# EAGLE design Word Clock (EAGLE 8.1.1)
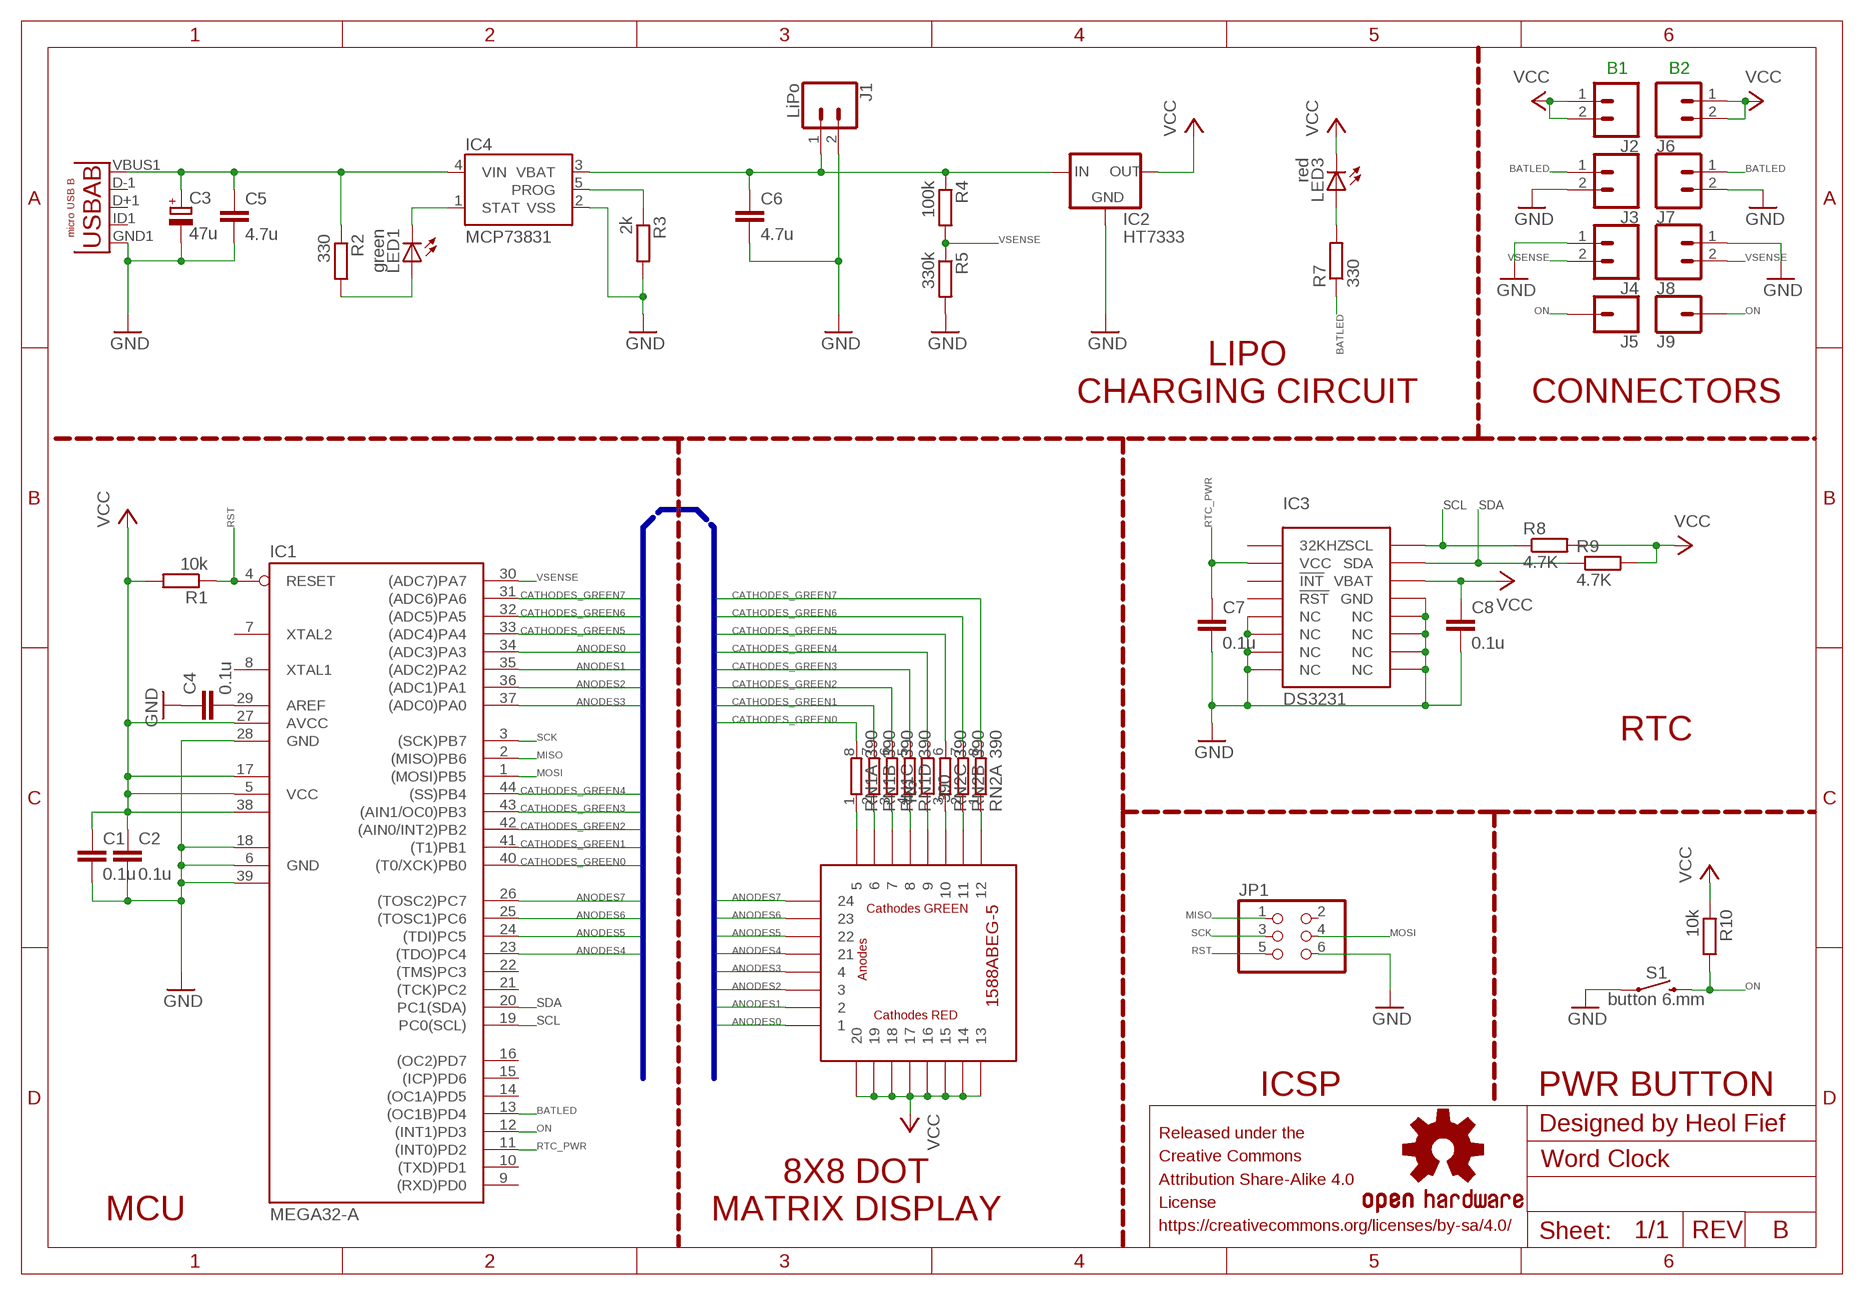
[diagram p0: schematic, sheet 1]

## Parts
C1  0.1u  C-EUC0805  [C0805]
C2  0.1u  C-EUC0805  [C0805]
C3  47u  CPOL-EUD/7343-31W  [D/7343-31W]
C4  0.1u  C-EUC0805  [C0805]
C5  4.7u  C-EUC0805  [C0805]
C6  4.7u  C-EUC0805  [C0805]
C7  0.1u  C-EUC0805  [C0805]
C8  0.1u  C-EUC0805  [C0805]
IC1  MEGA32-A  [TQFP44]
IC2  HT7333  [SOT-89]
IC3  DS3231  DS3231SOIC-16W  [SOIC-16W]
IC4  MCP73831  [SOT23-5]
J1  LiPo  CONN_02POLAR  [MOLEX-1X2]
J2  CONN_02  [1X02]
J3  CONN_02  [1X02]
J4  CONN_02  [1X02]
J5  CONN_01  [1X01]
J6  CONN_02  [1X02]
J7  CONN_02  [1X02]
J8  CONN_02  [1X02]
J9  CONN_01  [1X01]
J10  USB""  [USB-MICRO-SMD]
JP1  PINHD-2X3/90  [2X03/90]
LED1  green  LEDCHIPLED_1206  [CHIPLED_1206]
LED2  1588ABEG-5_8X8-LED_MATRIX  [1588ABEG-5_8X8-LED_MATRIX]
LED3  red  LEDCHIPLED_1206  [CHIPLED_1206]
LOGO1  OSHW-LOGOL-COPPER  [OSHW-LOGO-L_COPPER]
LOGO2  OSHW-LOGOL-COPPER  [OSHW-LOGO-L_COPPER]
R1  10k  R-EU_M0805  [M0805]
R2  330  R-EU_M0805  [M0805]
R3  2k  R-EU_M0805  [M0805]
R4  100k  R-EU_M0805  [M0805]
R5  330k  R-EU_M0805  [M0805]
R6  390  R-EU_R0805  [R0805]
R7  330  R-EU_M0805  [M0805]
R8  4.7K  R-EU_M0805  [M0805]
R9  4.7K  R-EU_M0805  [M0805]
R10  10k  R-EU_M0805  [M0805]
RN1  390  4R-N0603-ARC  [0603-ARC]
RN2  390  4R-N0603-ARC  [0603-ARC]
S1  button 6.mm  MOMENTARY-SWITCH-SPST-PTH-6.0MM  [TACTILE_SWITCH_PTH_6.0MM]

## Nets
ANODES0: IC1.34((ADC3)PA3) LED2.P$1
ANODES1: IC1.35((ADC2)PA2) LED2.P$2
ANODES2: IC1.36((ADC1)PA1) LED2.P$3
ANODES3: IC1.37((ADC0)PA0) LED2.P$4
ANODES4: IC1.23((TDO)PC4) LED2.P$21
ANODES5: IC1.24((TDI)PC5) LED2.P$22
ANODES6: IC1.25((TOSC1)PC6) LED2.P$23
ANODES7: IC1.26((TOSC2)PC7) LED2.P$24
AREF: C4.2 IC1.29(AREF)
BATLED: IC1.13((OC1B)PD4) J3.1 J7.1 R7.1
CATHODES_GREEN0: IC1.40((T0/XCK)PB0) RN1.8
CATHODES_GREEN1: IC1.41((T1)PB1) RN1.7
CATHODES_GREEN2: IC1.42((AIN0/INT2)PB2) RN1.6
CATHODES_GREEN3: IC1.43((AIN1/OC0)PB3) RN1.5
CATHODES_GREEN4: IC1.44((SS)PB4) R6.2
CATHODES_GREEN5: IC1.33((ADC4)PA4) RN2.6
CATHODES_GREEN6: IC1.32((ADC5)PA5) RN2.7
CATHODES_GREEN7: IC1.31((ADC6)PA6) RN2.8
GND: C1.2 C2.2 C3.- C4.1 C5.2 C6.2 C7.2 C8.2 IC1.6(GND) IC1.18(GND1) IC1.28(GND) IC1.39(GND2) IC2.2(GND) IC3.5(NC) IC3.6(NC) IC3.7(NC) IC3.8(NC) IC3.9(NC) IC3.10(NC) IC3.11(NC) IC3.12(NC) IC3.13(GND) IC4.2(VSS) J1.2 J3.2 J4.1 J7.2 J8.1 J10.GND1(GND) JP1.6 R3.2 R5.2 S1.1 S1.2
MISO: IC1.2((MISO)PB6) JP1.1
MOSI: IC1.1((MOSI)PB5) JP1.4
N$2: LED2.P$5 RN1.1
N$6: IC4.5(PROG) R3.1
N$7: LED2.P$6 RN1.2
N$8: LED2.P$7 RN1.3
N$9: C6.1 IC2.3(IN) IC2.4(IN) IC4.3(VBAT) J1.1 R4.1
N$10: LED2.P$8 RN1.4
N$11: LED1.A R2.2
N$12: IC4.1(STAT) LED1.C
N$13: C3.+ C5.1 IC4.4(VIN) J10.VBUS1(VBUS) R2.1
N$14: LED2.P$9 R6.1
N$15: LED2.P$10 RN2.3
N$16: LED2.P$11 RN2.2
N$17: LED2.P$12 RN2.1
N$18: LED3.A R7.2
ON: IC1.12((INT1)PD3) J5.1 J9.1 R10.2 S1.3 S1.4
RST: IC1.4(RESET) JP1.5 R1.1
RTC_PWR: C7.1 IC1.11((INT0)PD2) IC3.2(VCC)
SCK: IC1.3((SCK)PB7) JP1.3
SCL: IC1.19(PC0(SCL)) IC3.16(SCL) R8.1
SDA: IC1.20(PC1(SDA)) IC3.15(SDA) R9.1
VCC: C1.1 C2.1 C8.1 IC1.5(VCC) IC1.17(VCC1) IC1.27(AVCC) IC1.38(VCC2) IC2.1(OUT) IC3.14(VBAT) J2.1 J2.2 J6.1 J6.2 LED2.P$13 LED2.P$14 LED2.P$15 LED2.P$16 LED2.P$17 LED2.P$18 LED2.P$19 LED2.P$20 LED3.C R1.2 R8.2 R9.2 R10.1
VSENSE: IC1.30((ADC7)PA7) J4.2 J8.2 R4.2 R5.1
Unconnected: IC1.7(XTAL2) IC1.8(XTAL1) IC1.9((RXD)PD0) IC1.10((TXD)PD1) IC1.14((OC1A)PD5) IC1.15((ICP)PD6) IC1.16((OC2)PD7) IC1.21((TCK)PC2) IC1.22((TMS)PC3) IC3.1(32KHZ) IC3.3(!INT) IC3.4(!RST) J10.D+1(D+) J10.D-1(D-) J10.ID1(USBID) JP1.2 RN2.4 RN2.5

## Buses
ANODES[0..7],CATHODES_GREEN[0..7]

## Notes on the sheet
- B1 | B2
- micro USB B
- LIPO
  CHARGING CIRCUIT
- CONNECTORS
- RTC
- ICSP | PWR BUTTON
- Released under the 
  Creative Commons
  Attribution Share-Alike 4.0 
  License 
  https://creativecommons.org/licenses/by-sa/4.0/
- Designed by Heol Fief
- MCU
- 8X8 DOT
  MATRIX DISPLAY
- REV | B

## Library data of the parts
C1 C2 C4-C8 = rcl:C-EU: CAPACITOR, European symbol
C3 = rcl:CPOL-EU: POLARIZED CAPACITOR, European symbol
IC1 = atmel:MEGA32: MICROCONTROLLER 32 Kbytes FLASH 2 Kbytes SRAM 1 Kbytes EEPROM USART 8-channel 10 bit ADC Source: www.atmel.com .. doc2503.pdf; MPN: ATMEGA32-16AU; OC_FARNELL: 9171274; OC_NEWARK: 69K6677
IC2 = holtek2:HT73*
IC3 = DS3231_industrialberry:DS3231
IC4 = SparkFun-IC-Power:MCP73831: MCP73831T Li-Ion, Li-Pol Controller Miniature single cell, fully integrated Li-Ion, Li-polymer charge management controller Datasheet <http://ww1.microchip.com/downloads/en/DeviceDoc/20001984g.pdf> SparkFun Products: SparkFun ESP32 Thing <https://www.sparkfun.com/products/13907> SparkFun 9DoF Razor IMU M0 <https://www.sparkfun.com/products/14001>; PROD_ID: IC-09995
J1 = SparkFun-Connectors:CONN_02: Multi connection point. Often used as Generic Header-pin footprint for 0.1 inch spaced/style header connections On any of the 0.1 inch spaced packages, you can populate with these: Break Away Headers - Straight <https://www.sparkfun.com/products/116> (PRT-00116) Break Away Male Headers - Right Angle <https://www.sparkfun.com/products/553> (PRT-00553) Female Headers <https://www.sparkfun.com/products/115> (PRT-00115) Break Away Headers - Machine Pin <https://www.sparkfun.com/products/117> (PRT-00117) Break Away Female Headers - Swiss Machine Pin <https://www.sparkfun.com/products/743> (PRT-00743) For SCREWTERMINALS and SPRING TERMINALS visit here: Screw Terimnals on SparkFun.com <https://www.sparkfun.com/search/results?term=Screw+Terminals> (5mm/3.5mm/2.54mm spacing) This device is also useful as a general connection point to wire up your design to another part of your project. Our various solder wires solder well into these plated through hole pads. Hook-Up Wire - Assortment (Stranded, 22 AWG) <https://www.sparkfun.com/products/11375> (PRT-11375) Hook-Up Wire - Assortment (Solid Core, 22 AWG) <https://www.sparkfun.com/products/11367> (PRT-11367) View the entire wire category on our website here <https://www.sparkfun.com/categories/141> Special notes: Molex polarized connector foot print use with: PRT-08233 with associated crimp pins and housings. 2.54_SCREWTERM for use with PRT-10571. 3.5mm Screw Terminal footprints for PRT-08084 5mm Screw Terminal footprints for use with PRT-08432; SF_ID: PRT-09918
J2-J4 J6-J8 = SparkFun-Connectors:CONN_02: Multi connection point. Often used as Generic Header-pin footprint for 0.1 inch spaced/style header connections On any of the 0.1 inch spaced packages, you can populate with these: Break Away Headers - Straight <https://www.sparkfun.com/products/116> (PRT-00116) Break Away Male Headers - Right Angle <https://www.sparkfun.com/products/553> (PRT-00553) Female Headers <https://www.sparkfun.com/products/115> (PRT-00115) Break Away Headers - Machine Pin <https://www.sparkfun.com/products/117> (PRT-00117) Break Away Female Headers - Swiss Machine Pin <https://www.sparkfun.com/products/743> (PRT-00743) For SCREWTERMINALS and SPRING TERMINALS visit here: Screw Terimnals on SparkFun.com <https://www.sparkfun.com/search/results?term=Screw+Terminals> (5mm/3.5mm/2.54mm spacing) This device is also useful as a general connection point to wire up your design to another part of your project. Our various solder wires solder well into these plated through hole pads. Hook-Up Wire - Assortment (Stranded, 22 AWG) <https://www.sparkfun.com/products/11375> (PRT-11375) Hook-Up Wire - Assortment (Solid Core, 22 AWG) <https://www.sparkfun.com/products/11367> (PRT-11367) View the entire wire category on our website here <https://www.sparkfun.com/categories/141> Special notes: Molex polarized connector foot print use with: PRT-08233 with associated crimp pins and housings. 2.54_SCREWTERM for use with PRT-10571. 3.5mm Screw Terminal footprints for PRT-08084 5mm Screw Terminal footprints for use with PRT-08432
J5 J9 = SparkFun-Connectors:CONN_01: Single connection point. Often used as Generic Header-pin footprint for 0.1 inch spaced/style header connections On any of the 0.1 inch spaced packages, you can populate with these: Break Away Headers - Straight <https://www.sparkfun.com/products/116> (PRT-00116) Break Away Male Headers - Right Angle <https://www.sparkfun.com/products/553> (PRT-00553) Female Headers <https://www.sparkfun.com/products/115> (PRT-00115) Break Away Headers - Machine Pin <https://www.sparkfun.com/products/117> (PRT-00117) Break Away Female Headers - Swiss Machine Pin <https://www.sparkfun.com/products/743> (PRT-00743) This device is also useful as a general connection point to wire up your design to another part of your project. Our various solder wires solder well into these plated through hole pads. Hook-Up Wire - Assortment (Stranded, 22 AWG) <https://www.sparkfun.com/products/11375> (PRT-11375) Hook-Up Wire - Assortment (Solid Core, 22 AWG) <https://www.sparkfun.com/products/11367> (PRT-11367) View the entire wire category on our website here <https://www.sparkfun.com/categories/141> Special notes: SMTSO-256-ET is a "flush mount" nut for a 4-40 screw. We mostly use this on specialty testbeds; it is a nice way to connect hardware to your PCB at an adjustable hieght. Also note, the SNAP packages are for using a snappable style connector. We sell a baggie of snaps and they are also used on two LilyPad designs: Snap Assortment - 30 pack (male and female) <https://www.sparkfun.com/products/11347> (DEV-11347) LilyPad Arduino SimpleSnap <https://www.sparkfun.com/products/10941> (DEV-10941) LilyPad SimpleSnap Protoboard <https://www.sparkfun.com/products/10940> (DEV-10940)
J10 = MicroUSB:USB: This is a USB AB connector that is compatible with USB OTG. i.e. this connector can serve as a host or device
JP1 = pinhead:PINHD-2X3: PIN HEADER
LED1 LED3 = led:LED: LED OSRAM: - CHIPLED LG R971, LG N971, LY N971, LG Q971, LY Q971, LO R971, LY R971 LH N974, LH R974 LS Q976, LO Q976, LY Q976 LO Q996 - Hyper CHIPLED LW Q18S LB Q993, LB Q99A, LB R99A - SideLED LS A670, LO A670, LY A670, LG A670, LP A670 LB A673, LV A673, LT A673, LW A673 LH A674 LY A675 LS A676, LA A676, LO A676, LY A676, LW A676 LS A679, LY A679, LG A679 - Hyper Micro SIDELED® LS Y876, LA Y876, LO Y876, LY Y876 LT Y87S - SmartLED LW L88C, LW L88S LB L89C, LB L89S, LG L890 LS L89K, LO L89K, LY L89K LS L896, LA L896, LO L896, LY L896 - TOPLED LS T670, LO T670, LY T670, LG T670, LP T670 LSG T670, LSP T670, LSY T670, LOP T670, LYG T670 LG T671, LOG T671, LSG T671 LB T673, LV T673, LT T673, LW T673 LH T674 LS T676, LA T676, LO T676, LY T676, LB T676, LH T676, LSB T676, LW T676 LB T67C, LV T67C, LT T67C, LS T67K, LO T67K, LY T67K, LW E67C LS E67B, LA E67B, LO E67B, LY E67B, LB E67C, LV E67C, LT E67C LW T67C LS T679, LY T679, LG T679 LS T770, LO T770, LY T770, LG T770, LP T770 LB T773, LV T773, LT T773, LW T773 LH T774 LS E675, LA E675, LY E675, LS T675 LS T776, LA T776, LO T776, LY T776, LB T776 LHGB T686 LT T68C, LB T68C - Hyper Mini TOPLED® LB M676 - Mini TOPLED Santana® LG M470 LS M47K, LO M47K, LY M47K Source: http://www.osram.convergy.de LUXEON: - LUMILED® LXK2-PW12-R00, LXK2-PW12-S00, LXK2-PW14-U00, LXK2-PW14-V00 LXK2-PM12-R00, LXK2-PM12-S00, LXK2-PM14-U00 LXK2-PE12-Q00, LXK2-PE12-R00, LXK2-PE12-S00, LXK2-PE14-T00, LXK2-PE14-U00 LXK2-PB12-K00, LXK2-PB12-L00, LXK2-PB12-M00, LXK2-PB14-N00, LXK2-PB14-P00, LXK2-PB14-Q00 LXK2-PR12-L00, LXK2-PR12-M00, LXK2-PR14-Q00, LXK2-PR14-R00 LXK2-PD12-Q00, LXK2-PD12-R00, LXK2-PD12-S00 LXK2-PH12-R00, LXK2-PH12-S00 LXK2-PL12-P00, LXK2-PL12-Q00, LXK2-PL12-R00 Source: www.luxeon.com KINGBRIGHT: KA-3528ASYC Source: www.kingbright.com
LED2 = heol:1588ABEG-5_8X8-LED_MATRIX
LOGO1 LOGO2 = SparkFun-Aesthetics:OSHW-LOGO: Open-Source Hardware (OSHW) Logo This logo indicates the piece of hardware it is found on incorporates a OSHW license and/or adheres to the definition of open source hardware found here: http://freedomdefined.org/OSHW
R1-R5 R7-R10 = rcl:R-EU_: RESISTOR, European symbol
R6 = resistor:R-EU_: RESISTOR, European symbol
RN1 RN2 = resistor-dil:4R-N: Array Chip Resistor Source: RS Component / Phycomp; OC_FARNELL: unknown; OC_NEWARK: unknown
S1 = SparkFun-Switches:MOMENTARY-SWITCH-SPST: Momentary Switch (Pushbutton) - SPST Normally-open (NO) SPST momentary switches (buttons, pushbuttons). Variants PTH-12MM - 12mm square, through-hole Momentary Pushbutton Switch - 12mm Square <https://www.sparkfun.com/products/9190> (COM-09190) PTH-6.0MM, PTH-6.0MM-KIT - 6.0mm square, through-hole Mini Pushbutton Switch <https://www.sparkfun.com/products/97> (COM-00097) KIT package intended for soldering kit's - only one side of pads' copper is exposed. PTH-RIGHT-ANGLE-KIT - Right-angle, through-hole Right Angle Tactile Button <https://www.sparkfun.com/products/10791> - Used on SparkFun BigTime Watch Kit <https://www.sparkfun.com/products/11734> SMD-12MM - 12mm square, surface-mount Tactile Button - SMD (12mm) <https://www.sparkfun.com/products/12993> (COM-12993) Used on SparkFun PicoBoard <https://www.sparkfun.com/products/11888> SMD-4.5MM - 4.5mm Square Trackball Switch Used on SparkFun Blackberry Trackballer Breakout <https://www.sparkfun.com/products/13169> SMD-4.6MMX2.8MM - 4.60mm x 2.80mm, surface mount Used on SparkFun SAMD21 Mini Breakout <https://www.sparkfun.com/products/13664> SMD-5.2MM, SMD-5.2-REDUNDANT - 5.2mm square, surface-mount Mini Pushbutton Switch - SMD <https://www.sparkfun.com/products/8720> (COM-08720) Used on Arduino Pro Mini <https://www.sparkfun.com/products/11114> REDUNDANT package connects both switch circuits together SMD-6.0X3.5MM - 6.0 x 3.5mm, surface mount Momentary Reset Switch SMD <https://www.sparkfun.com/products/8229> (COM-08229) SMD-6.2MM-TALL - 6.2mm square, surface mount Tactile Button - SMD (6mm) <https://www.sparkfun.com/products/12992> Used on SparkFun Digital Sandbox <https://www.sparkfun.com/products/12651> SMD-RIGHT-ANGLE - Right-angle, surface mount Used on SparkFun Block for Intel® Edison - Arduino <https://www.sparkfun.com/products/13036>; PROD_ID: SWCH-08441; SF_SKU: COM-00097

## Board
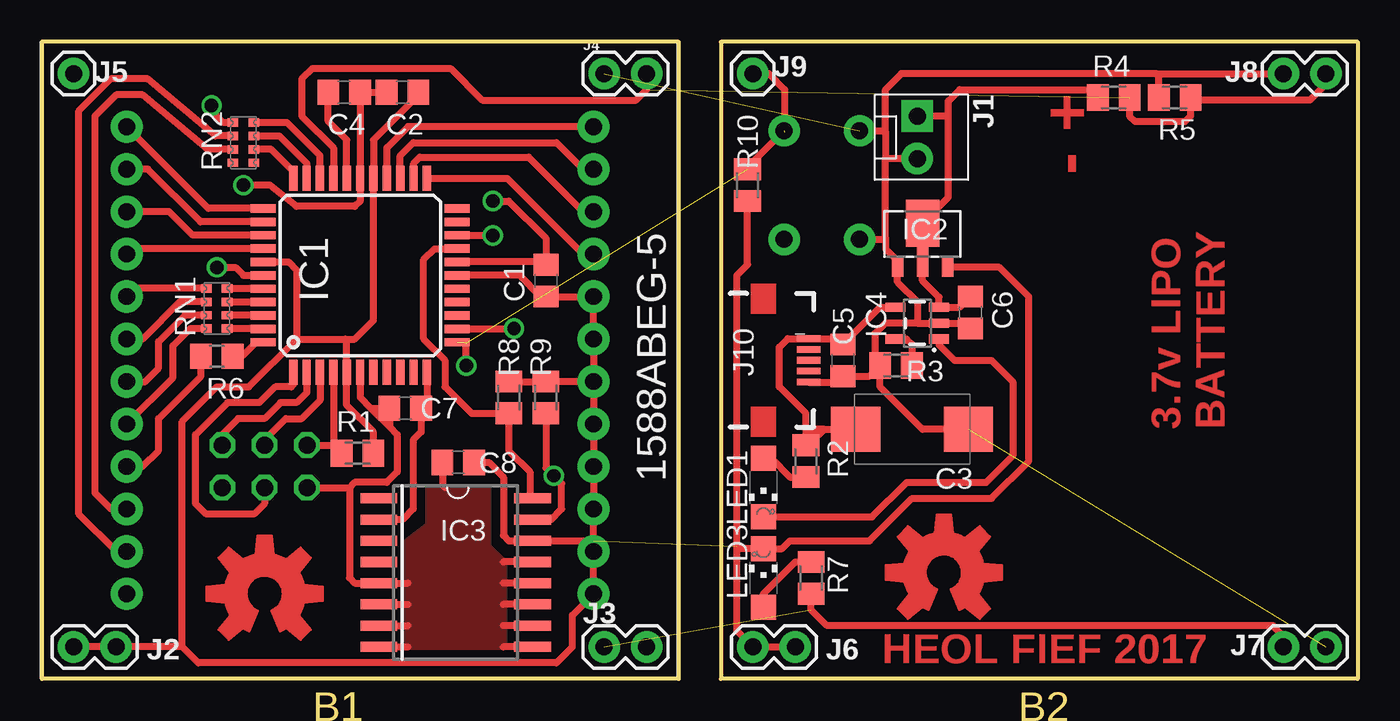
[diagram p1: board, top side]
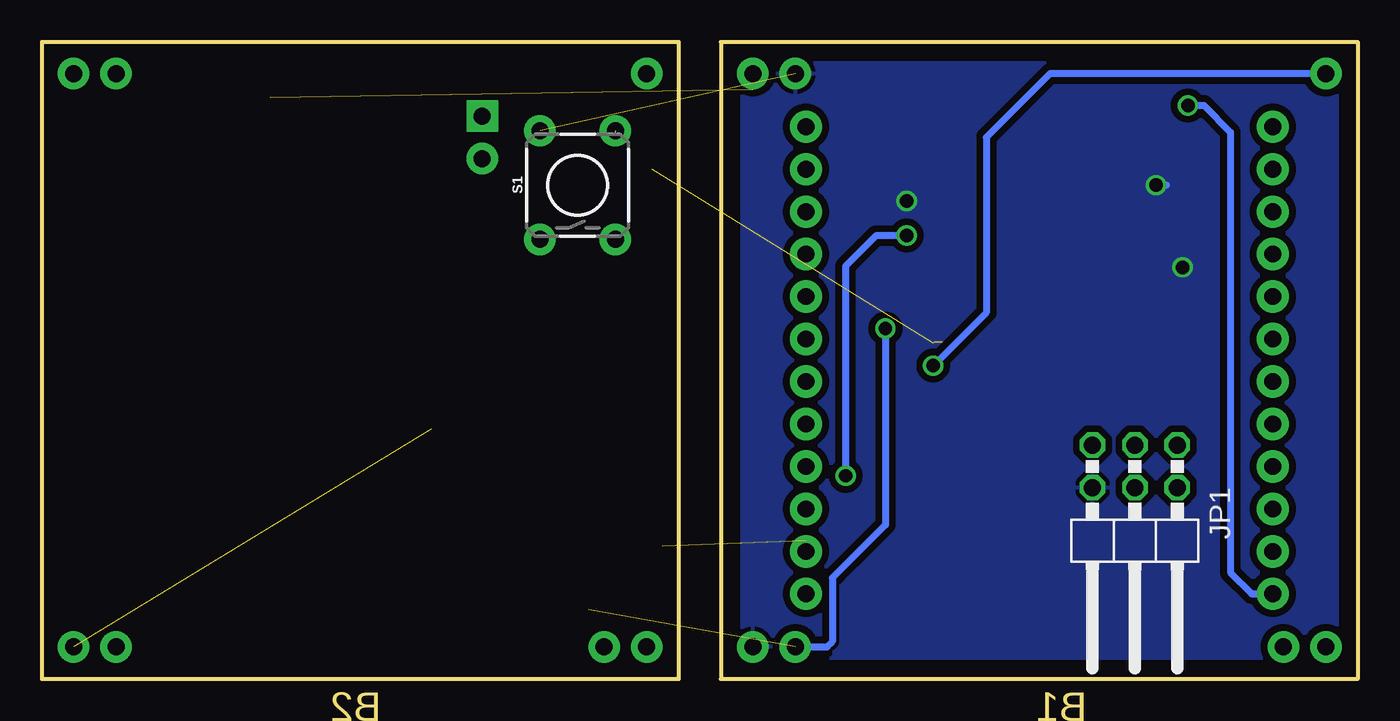
[diagram p2: board, bottom side, seen from below]

Size 78.74 x 38.1 mm. Coordinates in mm from the lower left corner, seen from the top.
Outline: 38.1,38.1 38.1,0 0,0 0,38.1 38.1,38.1
Outline: 78.74,38.1 78.74,0 40.64,0 40.64,38.1 78.74,38.1
Copper layers (1*16): Top 0.035mm / dielectric 1.5mm / Bottom 0.035mm
Design rules "default": minimum track width 10mil, minimum drill 24mil, track to track 8mil, track to pad 8mil, pad to pad 8mil, via to via 8mil, smd to smd 8mil, copper to edge 40mil, drill to drill 8mil, minimum pad ring 10mil, minimum via ring 8mil, stop-mask expansion 4mil, vias tented up to drill 0mil, thermal gap 10mil

### Footprints (pad centres in the part's own frame; a part is rotated, then mirrored left to right if it is on the bottom)
C0805 = smd 1.3 x 1.5: 1 -0.95,0; 2 0.95,0
D/7343-31W = smd 2.95 x 2.7: + 3.375,0; - -3.375,0
TQFP44 = smd 1.5 x 0.5: 1 -5.8,4; 2 -5.8,3.2; 3 -5.8,2.4; 4 -5.8,1.6; 5 -5.8,0.8; 6 -5.8,0; 7 -5.8,-0.8; 8 -5.8,-1.6; 9 -5.8,-2.4; 10 -5.8,-3.2; 11 -5.8,-4; 23 5.8,-4; 24 5.8,-3.2; 25 5.8,-2.4; 26 5.8,-1.6; 27 5.8,-0.8; 28 5.8,0; 29 5.8,0.8; 30 5.8,1.6; 31 5.8,2.4; 32 5.8,3.2; 33 5.8,4 | smd 0.5 x 1.5: 12 -4,-5.8; 13 -3.2,-5.8; 14 -2.4,-5.8; 15 -1.6,-5.8; 16 -0.8,-5.8; 17 0,-5.8; 18 0.8,-5.8; 19 1.6,-5.8; 20 2.4,-5.8; 21 3.2,-5.8; 22 4,-5.8; 34 4,5.8; 35 3.2,5.8; 36 2.4,5.8; 37 1.6,5.8; 38 0.8,5.8; 39 0,5.8; 40 -0.8,5.8; 41 -1.6,5.8; 42 -2.4,5.8; 43 -3.2,5.8; 44 -4,5.8
SOT-89 = smd 0.7 x 1.1: 1 1.5,-2.385; 2 -1.5,-2.385 | smd 0.7 x 1.8: 3 0,-2.035 | smd 2 x 2.8: 4 0,0.265
SOIC-16W = smd 0.6 x 2.2: 1 -4.445,-4.6; 2 -3.175,-4.6; 3 -1.905,-4.6; 4 -0.635,-4.6; 5 0.635,-4.6; 6 1.905,-4.6; 7 3.175,-4.6; 8 4.445,-4.6; 9 4.445,4.6; 10 3.175,4.6; 11 1.905,4.6; 12 0.635,4.6; 13 -0.635,4.6; 14 -1.905,4.6; 15 -3.175,4.6; 16 -4.445,4.6
SOT23-5 = smd 0.55 x 1.2: 1 -0.95,-1.3; 2 0,-1.3; 3 0.95,-1.3; 4 0.95,1.3; 5 -0.95,1.3
MOLEX-1X2 = drill 1.016 pad 1.88 square: 1 0,0 | drill 1.016 pad 1.88: 2 2.54,0
1X02 = drill 1.016 pad 1.88: 1 0,0; 2 2.54,0
1X01 = drill 1.016 pad 1.88: 1 0,0
USB-MICRO-SMD = smd 1.4 x 0.4: D+1 2.7,0; D-1 2.7,0.65; GND1 2.7,-1.3; ID1 2.7,-0.65; VBUS1 2.7,1.3
2X03/90 = drill 1.016 octagon: 1 -2.54,-6.35; 2 -2.54,-3.81; 3 0,-6.35; 4 0,-3.81; 5 2.54,-6.35; 6 2.54,-3.81
CHIPLED_1206 = smd 1.5 x 1.5: A 0,-1.75; C 0,1.75
1588ABEG-5_8X8-LED_MATRIX = drill 1 pad 1.93: P$1 0,0; P$2 2.54,0; P$3 5.08,0; P$4 7.62,0; P$5 10.16,0; P$6 12.7,0; P$7 15.24,0; P$8 17.78,0; P$9 20.32,0; P$10 22.86,0; P$11 25.4,0; P$12 27.94,0; P$13 27.94,27.94; P$14 25.4,27.94; P$15 22.86,27.94; P$16 20.32,27.94; P$17 17.78,27.94; P$18 15.24,27.94; P$19 12.7,27.94; P$20 10.16,27.94; P$21 7.62,27.94; P$22 5.08,27.94; P$23 2.54,27.94; P$24 0,27.94
M0805 = smd 1.3 x 1.6: 1 -0.95,0; 2 0.95,0
R0805 = smd 1.3 x 1.5: 1 -0.95,0; 2 0.95,0
0603-ARC = smd 0.5 x 0.65: 1 -1.2,-0.625; 2 -0.4,-0.625; 3 0.4,-0.625; 4 1.2,-0.625; 5 1.2,0.625; 6 0.4,0.625; 7 -0.4,0.625; 8 -1.2,0.625
TACTILE_SWITCH_PTH_6.0MM = drill 1.016 pad 1.88: 1 -3.251,2.261; 2 3.251,2.261; 3 -3.251,-2.261; 4 3.251,-2.261

### Placement (x,y rotation side)
C1  30.16,23.81 90 top
C2  21.59,35.08 180 top
C3  52.07,14.92 180 top
C4  18.1,35.08 180 top
C5  47.94,19.05 270 top
C6  55.56,21.91 270 top
C7  21.75,16.19 180 top
C8  24.92,12.94 180 top
IC1  19.05,24.13 90 top
IC2  52.7,26.99 0 top
IC3  24.77,6.35 270 top
IC4  52.39,21.27 90 top
J1  52.39,33.66 270 top
J2  4.45,1.91 180 top
J3  33.66,1.91 0 top
J4  33.66,36.2 0 top
J5  1.91,36.2 0 top
J6  45.09,1.91 180 top
J7  74.3,1.91 0 top
J8  74.3,36.2 0 top
J9  42.55,36.2 0 top
J10  43.18,19.05 0 top
JP1  13.34,7.62 180 bottom
LED1  43.18,11.43 180 top
LED2  5.08,33.02 270 top
LED3  43.18,6.03 0 top
LOGO1  53.98,6.35 0 top
LOGO2  13.34,5.08 0 top
R1  18.89,13.49 0 top
R2  45.72,13.02 270 top
R3  51.12,18.73 180 top
R4  64.14,34.77 0 top
R5  67.79,34.77 180 top
R6  10.48,19.29 0 top
R7  46.04,6.03 90 top
R8  27.94,16.83 90 top
R9  30.16,16.83 90 top
R10  42.23,29.53 90 top
RN1  10.48,22.15 270 top
RN2  12.06,32.07 270 top
S1  46.67,29.53 90 bottom

### Tracks (layer width: path | path; a pad name or v marks a point on that pad's centre or on a via)
ANODES0
  Top 0.406: IC1.34 9.97,28.13 LED2.P$1
ANODES1
  Top 0.406: IC1.35 9.5,27.33 6.35,30.48 LED2.P$2
ANODES2
  Top 0.406: IC1.36 9.03,26.53 7.62,27.94 LED2.P$3
ANODES3
  Top 0.406: IC1.37 5.41,25.73 LED2.P$4
ANODES4
  Top 0.406: LED2.P$21 32.38,25.4 27.86,29.93 IC1.23
ANODES5
  Top 0.406: IC1.24 22.25,30.82 22.62,31.19 29.13,31.19 32.38,27.94 LED2.P$22
ANODES6
  Top 0.406: IC1.25 21.45,31.29 22.23,32.07 30.8,32.07 32.38,30.48 LED2.P$23
ANODES7
  Top 0.406: IC1.26 20.65,31.76 21.91,33.02 LED2.P$24
AREF
  Top 0.406: IC1.29 18.25,32.23 17.14,33.34 C4.2
BATLED  (via drill 0.8)  (1 unrouted)
  Top 0.406: R7.1 46.04,4.13 46.99,3.17 73.66,3.17 74.3,2.54 J7.1 | IC1.13 28.23,20.93 v28.26,20.95
  Bottom 0.406: v28.26,20.95 28.26,9.21 31.43,6.03 31.43,2.22 31.75,1.91 J3.1
CATHODES_GREEN0
  Top 0.406: IC1.40 11.12,23.33 RN1.8
CATHODES_GREEN1
  Top 0.406: IC1.41 11.12,22.53 RN1.7
CATHODES_GREEN2
  Top 0.406: IC1.42 11.12,21.73 RN1.6
CATHODES_GREEN3
  Top 0.406: IC1.43 11.12,20.93 RN1.5
CATHODES_GREEN4
  Top 0.406: IC1.44 12.83,20.13 12.06,19.37 11.51,19.37 R6.2
CATHODES_GREEN5
  Top 0.406: RN2.6 13.73,31.67 15.05,30.35 IC1.33
CATHODES_GREEN6
  Top 0.406: IC1.32 15.85,30.82 14.21,32.47 RN2.7
CATHODES_GREEN7
  Top 0.406: RN2.8 14.68,33.27 16.65,31.29 IC1.31
GND  (via drill 0.8, 0.8 pad 0.8)  (2 unrouted)
  Top 0.406: IC1.39 12.06,24.13 11.59,24.61 v10.48,24.61 | IC1.6 19.05,16.83 19.68,16.19 | 18.41,11.43 18.73,11.75 20.64,11.75 21.27,12.38 21.27,14.61 20.8,15.08 | 18.41,11.43 18.41,6.03 18.73,5.71 IC3.5 21.91,5.71 | 19.68,16.19 C7.2 20.8,15.08 | 20.8,15.08 19.68,16.19 | JP1.6 18.41,11.43 | v26.99,28.57 27.94,28.57 30.16,26.35 C1.2 30.16,24.93 IC1.18 | 52.39,21.27 50.48,21.27 49.85,20.64 49.85,19.05 R3.2 | 52.39,21.27 IC4.2 55.25,21.27 C6.2 55.56,20.64 | R3.2 49.53,18.1 C5.2 47.59,17.75 J10.GND1 | 66.67,36.2 J8.1 | 66.67,36.2 51.43,36.2 50.48,35.24 50.48,32.7 | J1.2 50.48,31.11 | 52.39,21.27 52.39,22.54 51.2,23.73 IC2.2 51.2,25 50.48,25.72 50.48,26.35 | 50.48,26.35 50.48,31.11 | R5.2 66.84,36.03 66.67,36.2 | C2.2 C4.1 19.05,34.77 IC1.28 19.05,28.57 18.73,28.26 15.24,28.26 13.65,29.53 v12.06,29.53 | C3.- 52.7,14.92 50.16,17.46 R3.2 | C8.2 23.97,11.59 24.13,11.43 | IC3.6 21.91,4.45 | IC3.7 21.91,3.17 | IC3.8 21.91,1.91 | IC3.9 27.62,1.91 | IC3.10 27.62,3.17 | IC3.11 27.62,4.45 | IC3.12 27.62,5.71 | IC3.13 27.62,6.99 | 50.48,32.7 50.48,31.11 | S1.2 50.41,32.78 50.48,32.7 | S1.1 50.41,26.28 50.48,26.35
  Bottom 0.406: v12.06,29.53 11.43,29.53
  pour Bottom (isolate 0.406): 38.1,38.1 38.1,0 28.89,0 28.89,6.67 16.51,6.67 16.51,0 0,0 0,38.1
  pour Top: 23.18,11.43 26.67,11.43 26.67,7.94 27.62,6.99 27.62,1.91 21.91,1.91 21.91,8.26 23.18,9.21
MISO
  Top 0.406: JP1.1 10.79,14.61 11.75,15.56 13.34,15.56 14.29,16.51 15.24,16.51 15.85,17.12 IC1.2
MOSI
  Top 0.406: JP1.4 13.34,10.48 12.7,9.84 9.84,9.84 9.21,10.48 9.21,14.61 11.11,16.51 13.02,16.51 13.97,17.46 14.92,17.46 15.05,17.59 IC1.1
N$2
  Top 0.406: RN1.1 5.57,23.35 LED2.P$5
N$4
  pour Bottom: 16.51,6.67 29.92,6.67 31.43,5.16 31.43,0 16.51,0
N$6
  Top 0.406: IC4.5 51.75,20.32 52.07,20 R3.1
N$7
  Top 0.406: RN1.2 8.26,22.55 6.03,20.32 LED2.P$6
N$8
  Top 0.406: RN1.3 8.57,21.75 6.99,20.16 6.99,18.57 6.19,17.78 LED2.P$7
N$9
  Top 0.406: 53.69,22.25 IC4.3 | 55.25,22.54 C6.1 54.93,22.22 IC4.3 | IC4.3 53.69,22.83 52.7,23.81 IC2.3 IC2.4 54.24,28.79 54.24,33.66 | 54.24,33.66 J1.1 | 54.24,33.66 54.24,34.55 54.93,35.24 62.71,35.24 R4.1
N$10
  Top 0.406: RN1.4 8.88,20.95 7.86,19.92 7.86,18.02 LED2.P$8
N$11
  Top 0.406: LED1.A 43.65,13.18 44.77,12.06 R2.2
N$12
  Top 0.406: 53.69,20.29 IC4.1 53.69,19.97 54.61,19.05 56.83,19.05 58.1,17.78 58.1,13.34 56.52,11.75 51.75,11.75 49.69,9.68 LED1.C 43.18,10
N$13
  Top 0.406: IC4.4 50.16,22.23 C5.1 47.59,20.35 J10.VBUS1 44.64,20.35 44.13,19.84 44.13,17.46 45.72,15.88 45.72,14.92 | 45.72,14.92 45.72,14.61 | 45.72,14.61 R2.1 | 46.83,14.92 C3.+ | 46.83,14.92 45.72,14.92 | 45.72,14.61 46.51,14.61 46.83,14.92
N$14
  Top 0.406: LED2.P$9 6.03,12.7 6.99,13.65 6.99,15.56 9.53,18.1 R6.1
N$15
  Top 0.406: LED2.P$10 4.13,10.16 3.17,11.11 3.17,33.66 4.45,34.92 6.03,34.92 9.93,31.67 RN2.3
N$16
  Top 0.406: LED2.P$11 4.45,7.62 2.22,9.84 2.22,33.97 4.13,35.88 6.35,35.88 10.39,32.47 RN2.2
N$17  (via drill 0.8)
  Top 0.406: RN2.1 10.87,33.27 10.16,33.97 v10.16,34.29
  Bottom 0.406: LED2.P$12 6.35,5.08 7.62,6.35 7.62,32.7 9.21,34.29 v10.16,34.29
N$18
  Top 0.406: LED3.A 43.18,5.08 45.09,6.99 R7.2
ON  (via drill 0.8)  (3 unrouted)
  Top 0.406: v25.4,18.73 25.4,20.08 25.35,20.13 | J9.1 43.5,36.2 44.45,35.24 44.45,32.82 S1.4 42.23,30.59 R10.2 | 44.41,32.66 44.45,32.7
  Bottom 0.406: J5.1 18.41,36.2 22.23,32.38 22.23,21.91 v25.4,18.73
RST
  Top 0.406: JP1.5 17.46,13.97 | 17.46,13.97 17.78,13.65 R1.1 | IC1.4 17.45,13.98 17.46,13.97
RTC_PWR
  Top 0.406: IC3.2 21.59,9.53 22.23,10.16 22.23,14.29 22.7,14.76 C7.1 | IC1.11 23.05,16.54 C7.1 | 23.05,15.84 C7.1
SCK
  Top 0.406: IC1.3 16.65,16.65 15.56,15.56 14.61,15.56 13.34,14.29 JP1.3
SCL
  Top 0.406: IC1.19 24.84,25.72 23.5,25.72 22.86,25.08 22.86,20.32 24.13,19.05 24.13,17.46 25.72,15.88 26.98,15.88 R8.1 27.94,13.65 29.21,12.38 29.21,10.95 IC3.16 | IC3.16 28.57,10.79 | IC3.16 29.21,10.79
SDA  (via drill 0.8)
  Top 0.406: IC3.15 30.48,9.53 31.11,10.16 31.11,11.67 v30.64,12.14 30.16,12.62 R9.1 | IC1.20 26.81,26.53 v26.99,26.51
  Bottom 0.406: v26.99,26.51 28.81,26.51 30.64,24.69 v30.64,12.14
VCC  (1 unrouted)
  Top 0.406: 29.84,22.54 C1.1 | R1.2 19.84,14.77 18.25,16.36 IC1.5 18.25,20.25 18.18,20.32 | 8.41,1.91 J2.1 J2.2 | LED2.P$18 LED2.P$19 LED2.P$20 C1.1 | LED2.P$18 LED2.P$17 LED2.P$16 LED2.P$15 33.02,8.26 | 33.02,8.26 IC3.14 27.94,8.26 27.62,8.57 27.62,12.06 26.75,12.94 C8.1 | 33.02,8.26 LED2.P$14 LED2.P$13 31.75,3.81 31.75,1.91 30.8,0.95 9.37,0.95 8.41,1.91 | R8.2 R9.2 29.53,17.78 LED2.P$18 | IC2.1 57.31,24.6 59.05,22.86 59.05,13.02 56.83,10.79 52.07,10.79 49.53,8.26 44.77,8.26 44.3,7.78 LED3.C | 43.02,7.94 LED3.C | 41.59,7.94 41.59,2.86 J6.2 J6.1 | LED3.C 41.75,7.78 41.59,7.94 | IC1.17 28.57,24.13 29.84,22.86 C1.1 | 15.24,20.32 18.18,20.32 | 18.18,20.32 18.73,20.32 19.85,21.44 IC1.27 19.85,32.23 22.54,34.92 C2.1 | 15.24,20.32 12.38,17.46 10.48,17.46 8.41,15.4 8.41,1.91 | IC1.38 14.76,24.93 15.24,24.45 15.24,20.32 | R10.1 42.23,24.77 41.59,24.13 41.59,7.94
VSENSE  (1 unrouted)
  Top 0.406: J4.2 36.2,35.24 35.56,34.61 26.35,34.61 24.45,36.51 16.19,36.51 15.56,35.88 15.56,33.66 17.46,31.75 17.46,29.94 IC1.30 | J8.2 76.83,35.56 75.88,34.61 68.89,34.61 R5.1 68.74,33.65 68.42,33.34 65.41,33.34 65.08,33.66 R4.2

### Text on the board
Top: + | - | 3.7v LIPO / BATTERY | HEOL FIEF 2017
Dimension: B1 | B2
bRestrict: HEOL FIEF / 2017